# Altium schematic sheet 03_mcu_oscillators.SchDoc
size A; SheetNumber: 12; SheetTotal: 17
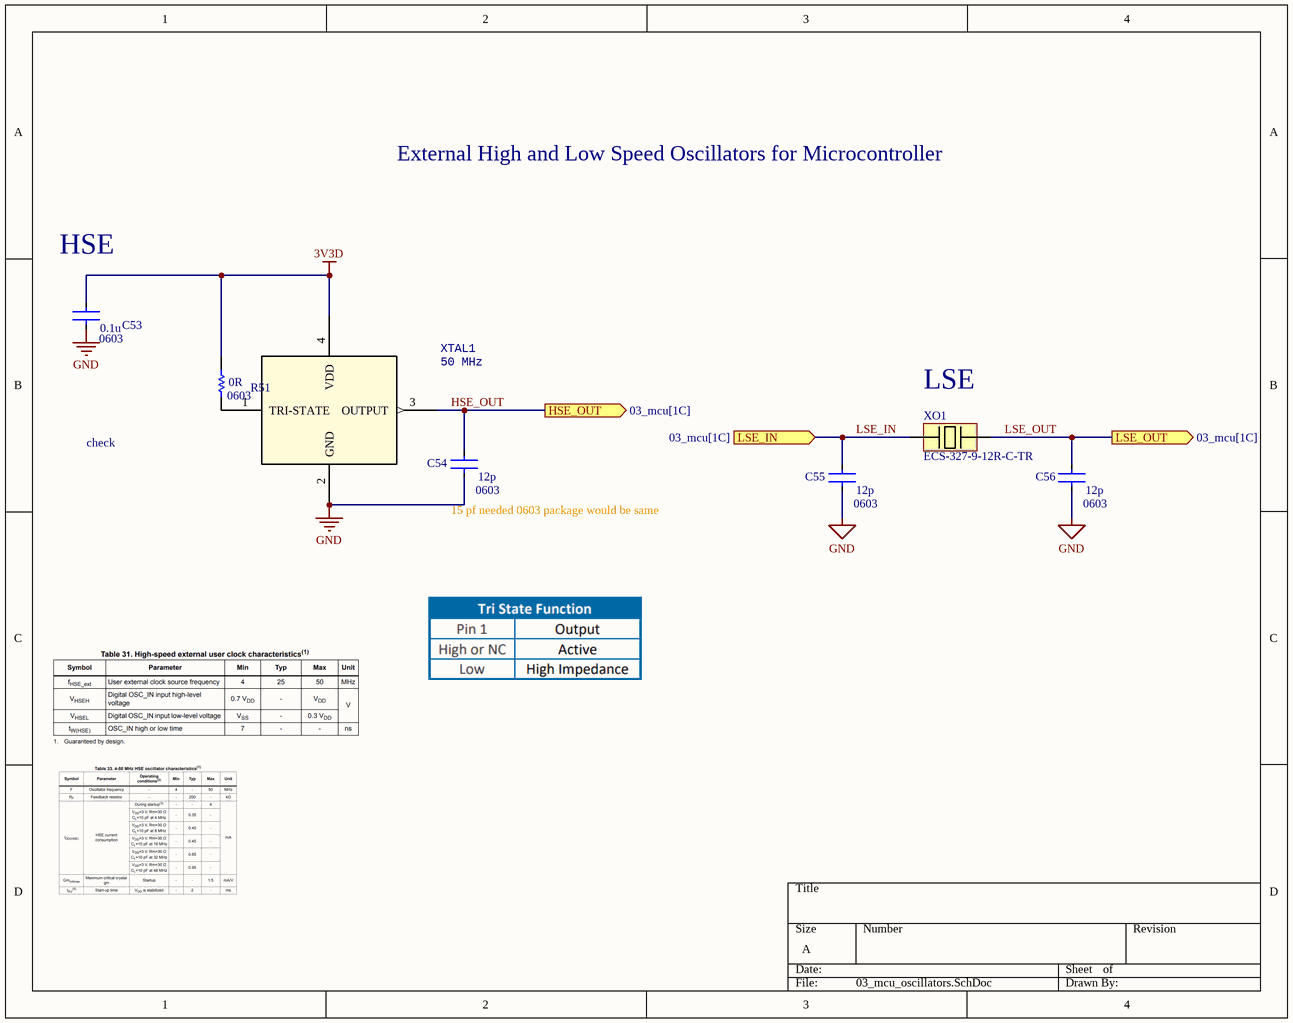
[diagram p0: 03_mcu_oscillators.SchDoc]

## Parts
C53  CGA3E2X7R1H104K080AA  [CAPTDK0603]  (value not drawn)
C54  CGA3E2C0G1H120J080AA  [CAPTDK0603]  (value not drawn)
C55  CGA3E2C0G1H120J080AA  [CAPTDK0603]  (value not drawn)
C56  CGA3E2C0G1H120J080AA  [CAPTDK0603]  (value not drawn)
R51  RMCF0603ZT0R00  [RES-STACK-POLE-0603]  (value not drawn)
XO1  ECS-327-9-12R-C-TR  [LSE-32K]
XTAL1  50 MHz  [ECS-2520S]

## Ports
HSE_OUT (out, see 03_mcu[1C]), LSE_IN (in, see 03_mcu[1C]), LSE_OUT (out, see 03_mcu[1C])

## Nets
3V3D: C53.1 R51.2 XTAL1.4(VDD)
GND: C53.2 C54.2 C55.2 C56.2 XTAL1.2(GND)
HSE_OUT: C54.1 XTAL1.3(OUTPUT) ; port HSE_OUT
LSE_IN: C55.1 XO1.1 ; port LSE_IN
LSE_OUT: C56.1 XO1.2 ; port LSE_OUT
NetR51_1: R51.1 XTAL1.1(TRI-STATE)

## Notes on the sheet
- External High and Low Speed Oscillators for Microcontroller
- (near C53) HSE
- (near XO1) LSE
- check
- (near C54) 15 pf needed 0603 package would be same
- (in symbol CGA3E2C0G1H120J080AA) 12p; 0603
- (in symbol CGA3E2X7R1H104K080AA) 0.1u; 0603
- (in symbol RMCF0603ZT0R00) 0R; 0603

## Library data of the parts
C53 = CGA3E2X7R1H104K080AA: CAP CER 0.1UF 50V X7R 0603; Supplier 1: Digi-Key; Supplier Part Number 1: 445-5666-1-ND
C54-C56 = CGA3E2C0G1H120J080AA: CAP CER 12PF 50V C0G 0603; Supplier 1: Digi-Key; Supplier Part Number 1: 445-5629-1-ND
R51 = RMCF0603ZT0R00: RES 0 OHM JUMPER 1/10W 0603; Supplier 1: Digi-Key; Supplier Part Number 1: RMCF0603ZT0R00CT-ND
XO1 = ECS-327-9-12R-C-TR: Crystal 0.032768MHz ±10ppm (Tol) 9pF Flexural 70000Ohm Automotive 2-Pin Ultra Mini-CSMD T/R; Manufacturer: ECS International; Manufacturer Part Number: ECS-.327-9-12R-C-TR; Frequency: 32.768kHz; ESR (Equivalent Series Resistance): 70kR; Supplier 1: Digi-Key; RoHS: Yes; Stock 1: 152; Pricing 1: 1=0.79000, 10=0.65700, 50=0.59160, 100=0.52580, 500=0.49952, 1000=0.42064 (USD); Mount: Surface Mount; Case/Package: SMD/SMT; Min Operating Temperature: -40°C; Max Operating Temperature: 85°C; Packaging: Tape and Reel; Frequency Tolerance: 10ppm; Load Capacitance: 9pF; ComponentLink1URL: https://www.ecsxtal.com/store/pdf/ECX-12R.pdf?src-supplier=Digi-Key; ComponentLink1Description: https://www.ecsxtal.com/store/pdf/ECX-12R.pdf?src-supplier=Digi-Key; Supplier Part Number 1: XC2744CT-ND
XTAL1 = ECS-2520S33-500-FN-TR: XTAL OSC XO 50.0000MHZ HCMOS SMD; Supplier 1: Digikey; Supplier Part Number 1: XC2202CT-ND